# EAGLE schematic VCO (EAGLE 7.7.0)
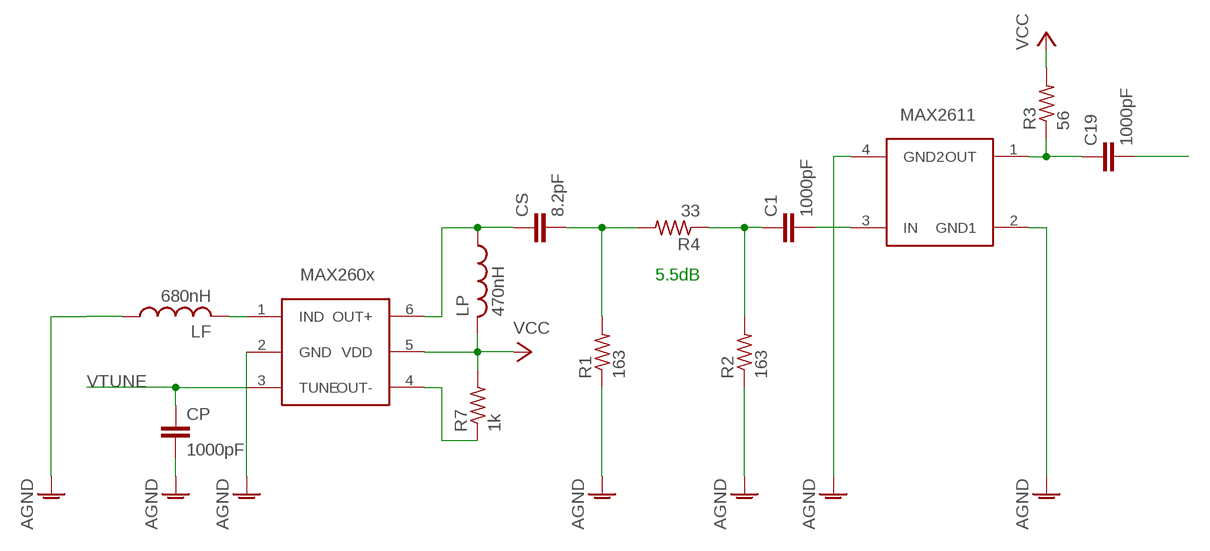
[diagram p0: schematic, sheet 1]

## Parts
C1  1000pF  C-EUC0805  [C0805]
C19  1000pF  C-EUC0805  [C0805]
CP  1000pF  C-EUC0805  [C0805]
CS  8.2pF  C-EUC0805  [C0805]
LF  680nH  L  [COILCRAFT_0805HP]
LP  470nH  L  [COILCRAFT_0805HP]
R1  163  R-US_R0805  [R0805]
R2  163  R-US_R0805  [R0805]
R3  56  R-US_R0805  [R0805]
R4  33  R-US_R0805  [R0805]
R7  1k  R-US_R0805  [R0805]
U$3  MAX2611  [SOT143-4]
U$4  MAX260X  [SOT23-6]

## Nets
AGND: CP.2 R1.1 R2.1 U$3.2(GND1) U$3.4(GND2) U$4.2(GND)
N$1 [rf_path]: CS.1 LP.1 U$4.6(OUT+)
N$2: LF.1
N$3: LP.2 R7.2 U$4.5(VDD)
N$4: CS.2 R1.2 R4.2
N$5: C1.1 R2.2 R4.1
N$6: C1.2 U$3.3(IN)
N$13 [rf_path]: C19.1 R3.1 U$3.1(OUT)
N$14: R7.1 U$4.4(OUT-)
N$18 [rf_path]: C19.2
N$20: LF.2 U$4.1(IND)
VCC: R3.2
VTUNE: CP.1 U$4.3(TUNE)

## Notes on the sheet
- 5.5dB

## Library data of the parts
C1 C19 CP CS = resistor:C-EU: CAPACITOR, European symbol
LF LP = FM_transmitter:L
R1-R4 R7 = resistor:R-US_: RESISTOR, American symbol
U$3 = FM_transmitter:MAX2611
U$4 = FM_transmitter:MAX260X

## Net classes
2 rf_path: clearance 1.016 mm